# Altium schematic sheet FPGA Board Top.SchDoc
size A
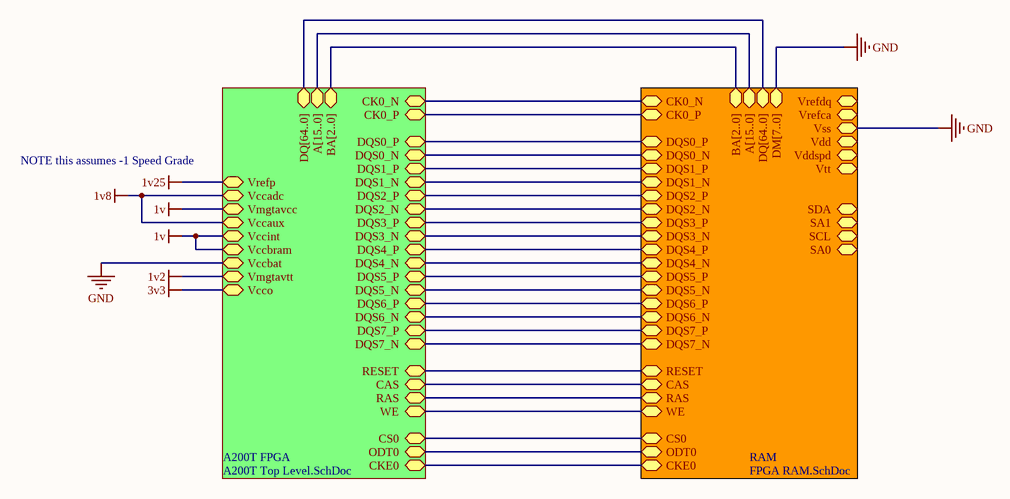
[diagram p0: FPGA Board Top.SchDoc]

## Sub-sheets
A200T FPGA = A200T Top Level.SchDoc: BA[2..0] (bidir), A[15..0] (bidir), DQ[64..0] (bidir), DQS1_P (bidir), DQS2_N (bidir), DQS7_N (bidir), DQS0_P (bidir), DQS6_N (bidir), DQS6_P (bidir), DQS1_N (bidir), DQS7_P (bidir), DQS4_P (bidir), DQS5_N (bidir), DQS3_P (bidir), DQS0_N (bidir), DQS2_P (bidir), DQS3_N (bidir), DQS4_N (bidir), DQS5_P (bidir), RAS (bidir), RESET (bidir), WE (bidir), CAS (bidir), CK0_P (bidir), CK0_N (bidir), ODT0 (bidir), CS0 (bidir), CKE0 (bidir), Vrefp (bidir), Vccadc (bidir), Vmgtavcc (bidir), Vccaux (bidir), Vccint (bidir), Vccbram (bidir), Vccbat (bidir), Vmgtavtt (bidir), Vcco (bidir)
RAM = FPGA RAM.SchDoc: DM[7..0] (bidir), DQ[64..0] (bidir), Vrefdq (bidir), Vrefca (bidir), Vss (bidir), Vdd (bidir), DQS0_P (bidir), DQS6_N (bidir), DQS7_P (bidir), DQS1_P (bidir), DQS7_N (bidir), DQS3_P (bidir), DQS1_N (bidir), DQS4_N (bidir), DQS2_P (bidir), DQS5_P (bidir), DQS3_N (bidir), DQS4_P (bidir), DQS5_N (bidir), DQS2_N (bidir), DQS0_N (bidir), DQS6_P (bidir), SDA (bidir), SA1 (bidir), SCL (bidir), SA0 (bidir), Vddspd (bidir), Vtt (bidir), BA[2..0] (bidir), A[15..0] (bidir), CK0_N (bidir), CK0_P (bidir), RESET (bidir), CAS (bidir), RAS (bidir), WE (bidir), CS0 (bidir), ODT0 (bidir), CKE0 (bidir)

## Nets
1v: sheet A200T FPGA/Vmgtavcc, sheet A200T FPGA/Vccint, sheet A200T FPGA/Vccbram
1v2: sheet A200T FPGA/Vmgtavtt
1v8: sheet A200T FPGA/Vccadc, sheet A200T FPGA/Vccaux
1v25: sheet A200T FPGA/Vrefp
3v3: sheet A200T FPGA/Vcco
GND: sheet A200T FPGA/Vccbat, sheet RAM/DM[7..0], sheet RAM/Vss
(unnamed): sheet A200T FPGA/BA[2..0], sheet RAM/BA[2..0]
(unnamed): sheet A200T FPGA/A[15..0], sheet RAM/A[15..0]
(unnamed): sheet A200T FPGA/DQ[64..0], sheet RAM/DQ[64..0]
(unnamed): sheet A200T FPGA/DQS1_P, sheet RAM/DQS1_P
(unnamed): sheet A200T FPGA/DQS2_N, sheet RAM/DQS2_N
(unnamed): sheet A200T FPGA/DQS7_N, sheet RAM/DQS7_N
(unnamed): sheet A200T FPGA/DQS0_P, sheet RAM/DQS0_P
(unnamed): sheet A200T FPGA/DQS6_N, sheet RAM/DQS6_N
(unnamed): sheet A200T FPGA/DQS6_P, sheet RAM/DQS6_P
(unnamed): sheet A200T FPGA/DQS1_N, sheet RAM/DQS1_N
(unnamed): sheet A200T FPGA/DQS7_P, sheet RAM/DQS7_P
(unnamed): sheet A200T FPGA/DQS4_P, sheet RAM/DQS4_P
(unnamed): sheet A200T FPGA/DQS5_N, sheet RAM/DQS5_N
(unnamed): sheet A200T FPGA/DQS3_P, sheet RAM/DQS3_P
(unnamed): sheet A200T FPGA/DQS0_N, sheet RAM/DQS0_N
(unnamed): sheet A200T FPGA/DQS2_P, sheet RAM/DQS2_P
(unnamed): sheet A200T FPGA/DQS3_N, sheet RAM/DQS3_N
(unnamed): sheet A200T FPGA/DQS4_N, sheet RAM/DQS4_N
(unnamed): sheet A200T FPGA/DQS5_P, sheet RAM/DQS5_P
(unnamed): sheet A200T FPGA/RAS, sheet RAM/RAS
(unnamed): sheet A200T FPGA/RESET, sheet RAM/RESET
(unnamed): sheet A200T FPGA/WE, sheet RAM/WE
(unnamed): sheet A200T FPGA/CAS, sheet RAM/CAS
(unnamed): sheet A200T FPGA/CK0_P, sheet RAM/CK0_P
(unnamed): sheet A200T FPGA/CK0_N, sheet RAM/CK0_N
(unnamed): sheet A200T FPGA/ODT0, sheet RAM/ODT0
(unnamed): sheet A200T FPGA/CS0, sheet RAM/CS0
(unnamed): sheet A200T FPGA/CKE0, sheet RAM/CKE0

## Notes on the sheet
- NOTE this assumes -1 Speed Grade